# EAGLE design U2FHIDDevice_1 (EAGLE 7.7.0)

## Sheet 1 of 3
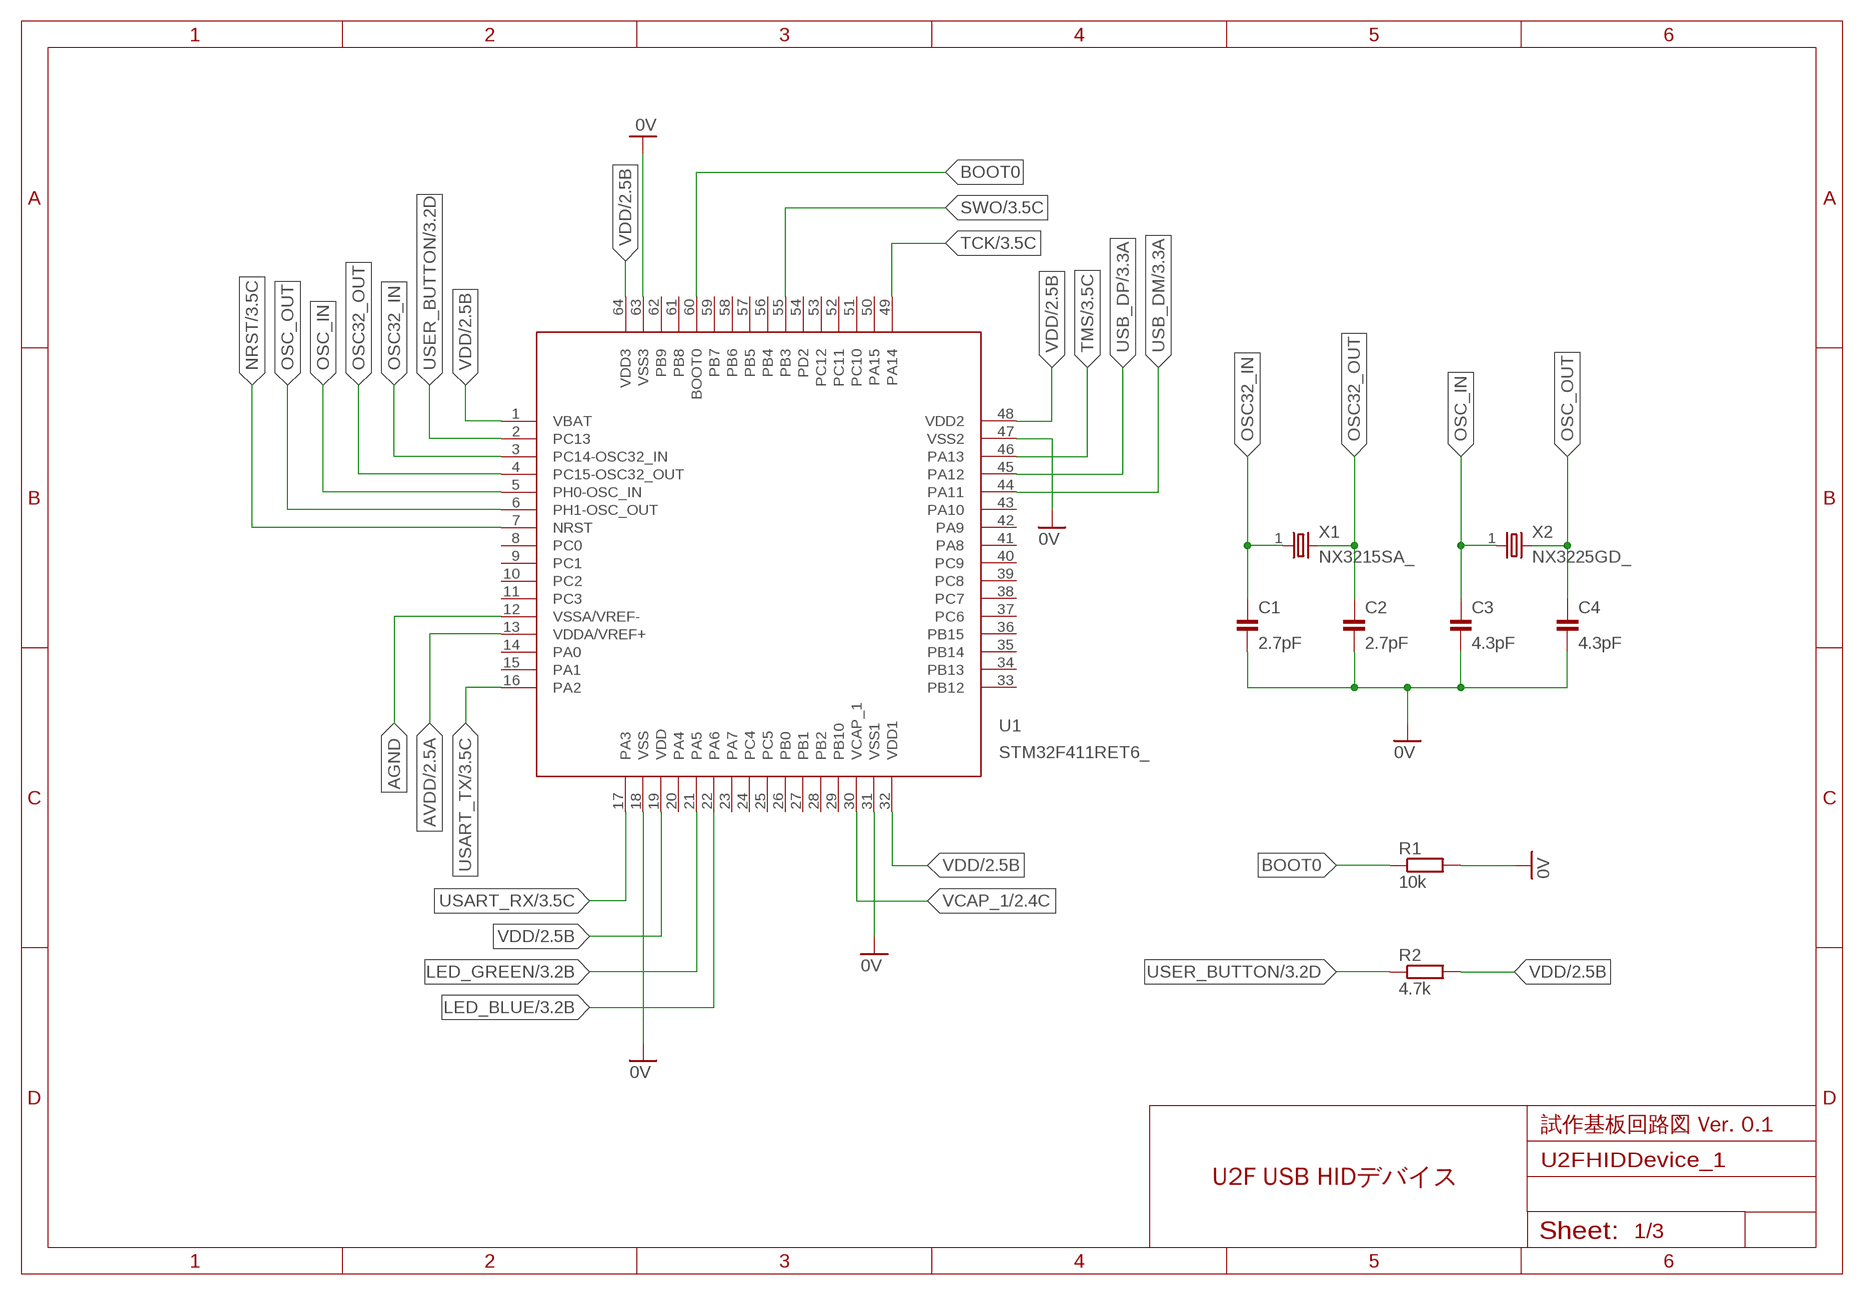
[diagram p0: schematic, sheet 1]

### Parts
C1  2.7pF  CAP_0603  [C0603K]
C2  2.7pF  CAP_0603  [C0603K]
C3  4.3pF  CAP_0603  [C0603K]
C4  4.3pF  CAP_0603  [C0603K]
R1  10k  RESISTOR_0603  [R0603]
R2  4.7k  RESISTOR_0603  [R0603]
U1  STM32F411RET6_  [LQFP64-10X10_DEV]
X1  NX3215SA_  [NX3215_DEV]
X2  NX3225GD_  [NX3225_DEV]

### Nets
0V: C1.2 C2.2 C3.2 C4.2 R1.2 U1.18(VSS) U1.31(VSS1) U1.47(VSS2) U1.63(VSS3) ; also sheet 2,3
AGND: U1.12(VSSA/VREF-) ; also sheet 2
AVDD: U1.13(VDDA/VREF+) ; also sheet 2
BOOT0: R1.1 U1.60(BOOT0)
LED_BLUE: U1.22(PA6) ; also sheet 3
LED_GREEN: U1.21(PA5) ; also sheet 3
NRST: U1.7(NRST) ; also sheet 3
OSC32_IN: C1.1 U1.3(PC14-OSC32_IN) X1.1
OSC32_OUT: C2.1 U1.4(PC15-OSC32_OUT) X1.2
OSC_IN: C3.1 U1.5(PH0-OSC_IN) X2.1
OSC_OUT: C4.1 U1.6(PH1-OSC_OUT) X2.2
SWO: U1.55(PB3) ; also sheet 3
TCK: U1.49(PA14) ; also sheet 3
TMS: U1.46(PA13) ; also sheet 3
USART_RX: U1.17(PA3) ; also sheet 3
USART_TX: U1.16(PA2) ; also sheet 3
USB_DM: U1.44(PA11) ; also sheet 3
USB_DP: U1.45(PA12) ; also sheet 3
USER_BUTTON: R2.1 U1.2(PC13) ; also sheet 3
VCAP_1: U1.30(VCAP_1) ; also sheet 2
VDD: R2.2 U1.1(VBAT) U1.19(VDD) U1.32(VDD1) U1.48(VDD2) U1.64(VDD3) ; also sheet 2
Unconnected: U1.8(PC0) U1.9(PC1) U1.10(PC2) U1.11(PC3) U1.14(PA0) U1.15(PA1) U1.20(PA4) U1.23(PA7) U1.24(PC4) U1.25(PC5) U1.26(PB0) U1.27(PB1) U1.28(PB2) U1.29(PB10) U1.33(PB12) U1.34(PB13) U1.35(PB14) U1.36(PB15) U1.37(PC6) U1.38(PC7) U1.39(PC8) U1.40(PC9) U1.41(PA8) U1.42(PA9) U1.43(PA10) U1.50(PA15) U1.51(PC10) U1.52(PC11) U1.53(PC12) U1.54(PD2) U1.56(PB4) U1.57(PB5) U1.58(PB6) U1.59(PB7) U1.61(PB8) U1.62(PB9)

### Notes on the sheet
- 試作基板回路図 Ver. 0.1
- U2F USB HIDデバイス

## Sheet 2 of 3
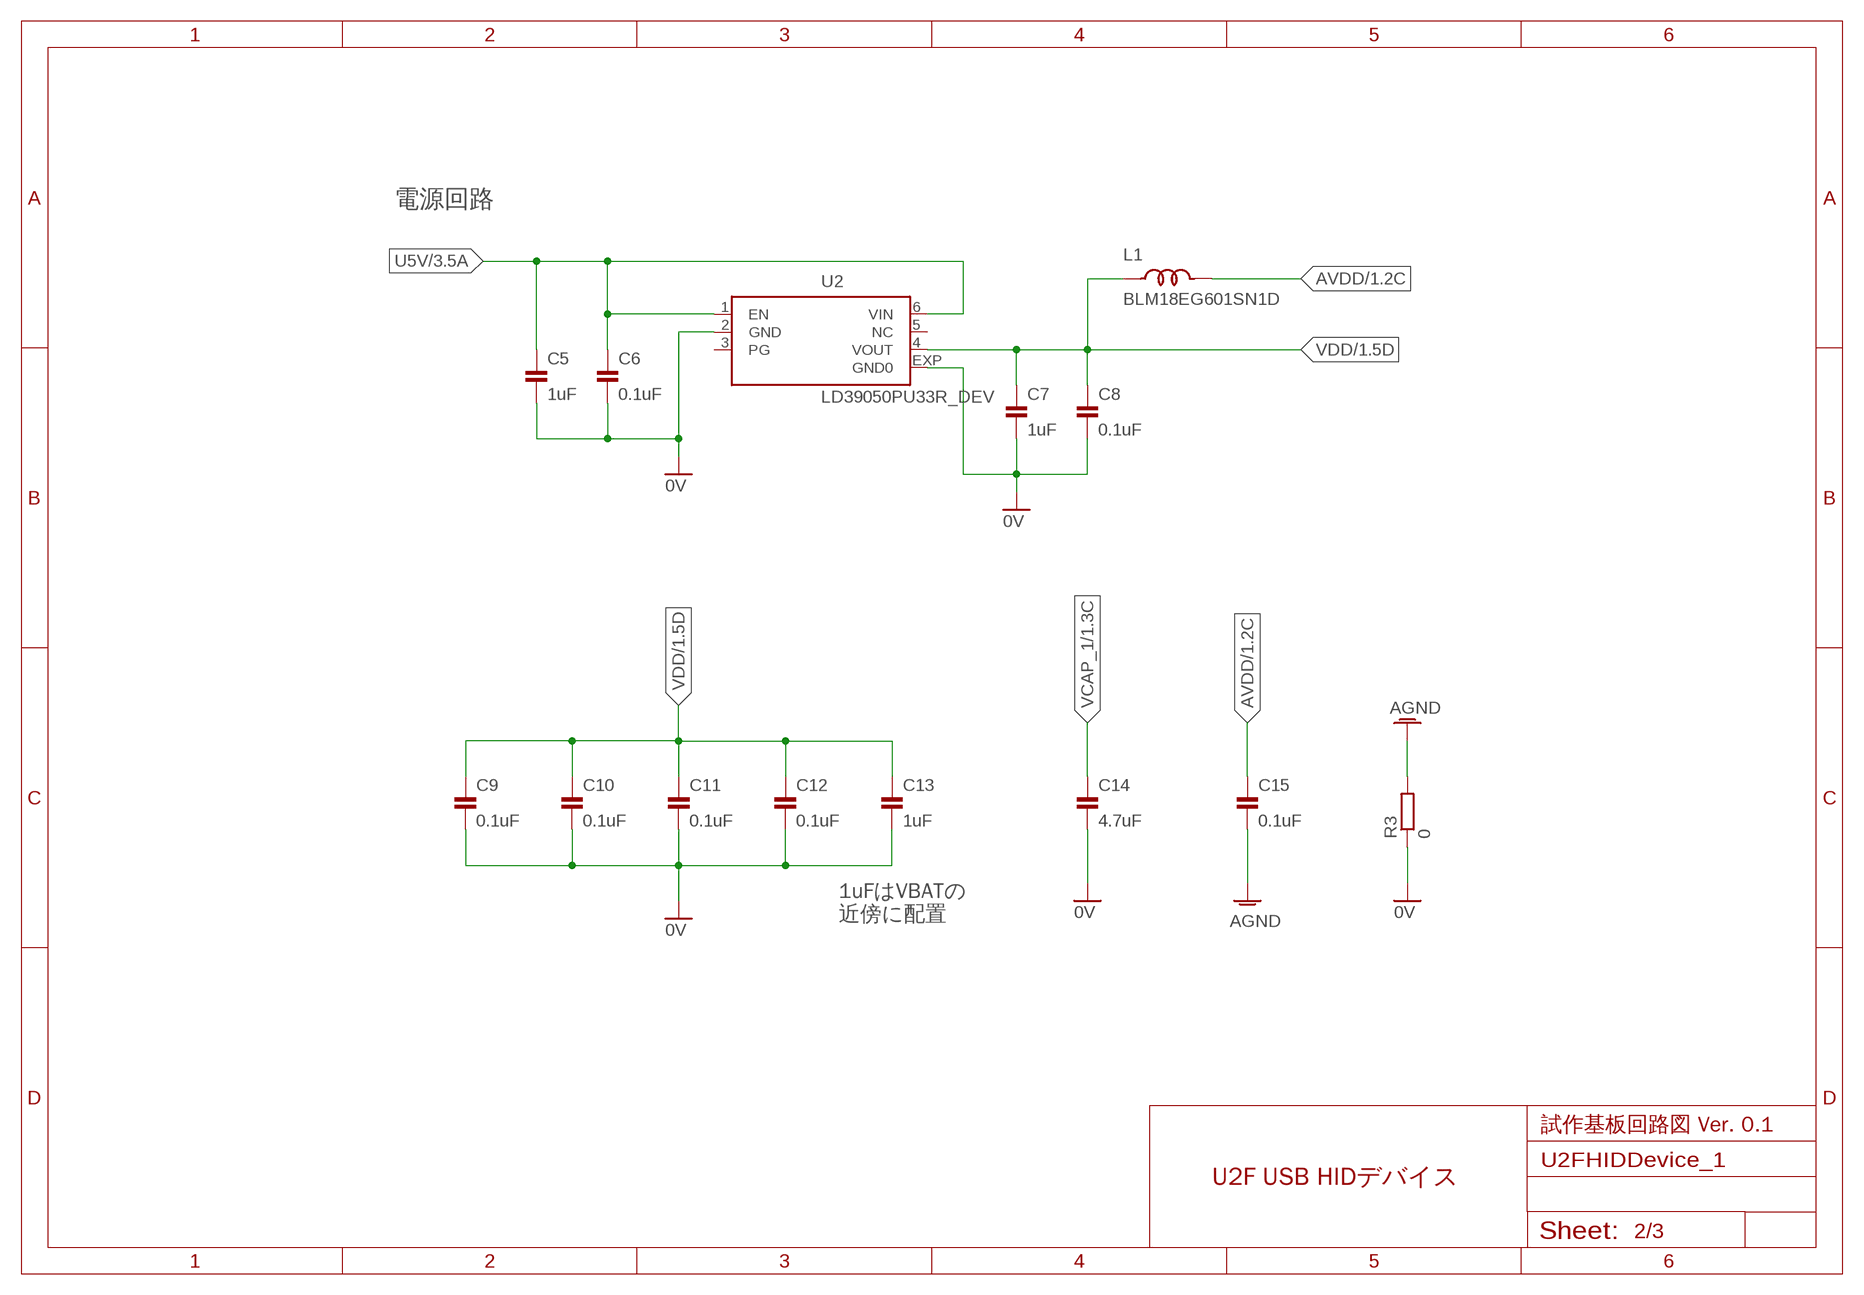
[diagram p1: schematic, sheet 2]

### Parts
C5  1uF  CAP_0603  [C0603K]
C6  0.1uF  CAP_0603  [C0603K]
C7  1uF  CAP_0603  [C0603K]
C8  0.1uF  CAP_0603  [C0603K]
C9  0.1uF  CAP_0603  [C0603K]
C10  0.1uF  CAP_0603  [C0603K]
C11  0.1uF  CAP_0603  [C0603K]
C12  0.1uF  CAP_0603  [C0603K]
C13  1uF  CAP_0603  [C0603K]
C14  4.7uF  CAP_1206  [C1206]
C15  0.1uF  CAP_0603  [C0603K]
L1  BLM18EG601SN1D  [R0603]
R3  0  RESISTOR_0603  [R0603]
U2  LD39050PU33R_DEV  [DFN6-3X3_DEV]

### Nets
0V: C5.2 C6.2 C7.2 C8.2 C9.2 C10.2 C11.2 C12.2 C13.2 C14.2 R3.1 U2.2(GND) U2.EXP(GND0) ; also sheet 1,3
AGND: C15.2 R3.2 ; also sheet 1
AVDD: C15.1 L1.2 ; also sheet 1
U5V: C5.1 C6.1 U2.1(EN) U2.6(VIN) ; also sheet 3
VCAP_1: C14.1 ; also sheet 1
VDD: C7.1 C8.1 C9.1 C10.1 C11.1 C12.1 C13.1 L1.1 U2.4(VOUT) ; also sheet 1
Unconnected: U2.3(PG) U2.5(NC)

### Notes on the sheet
- 電源回路
- 1uFはVBATの
  近傍に配置
- 試作基板回路図 Ver. 0.1
- U2F USB HIDデバイス

## Sheet 3 of 3
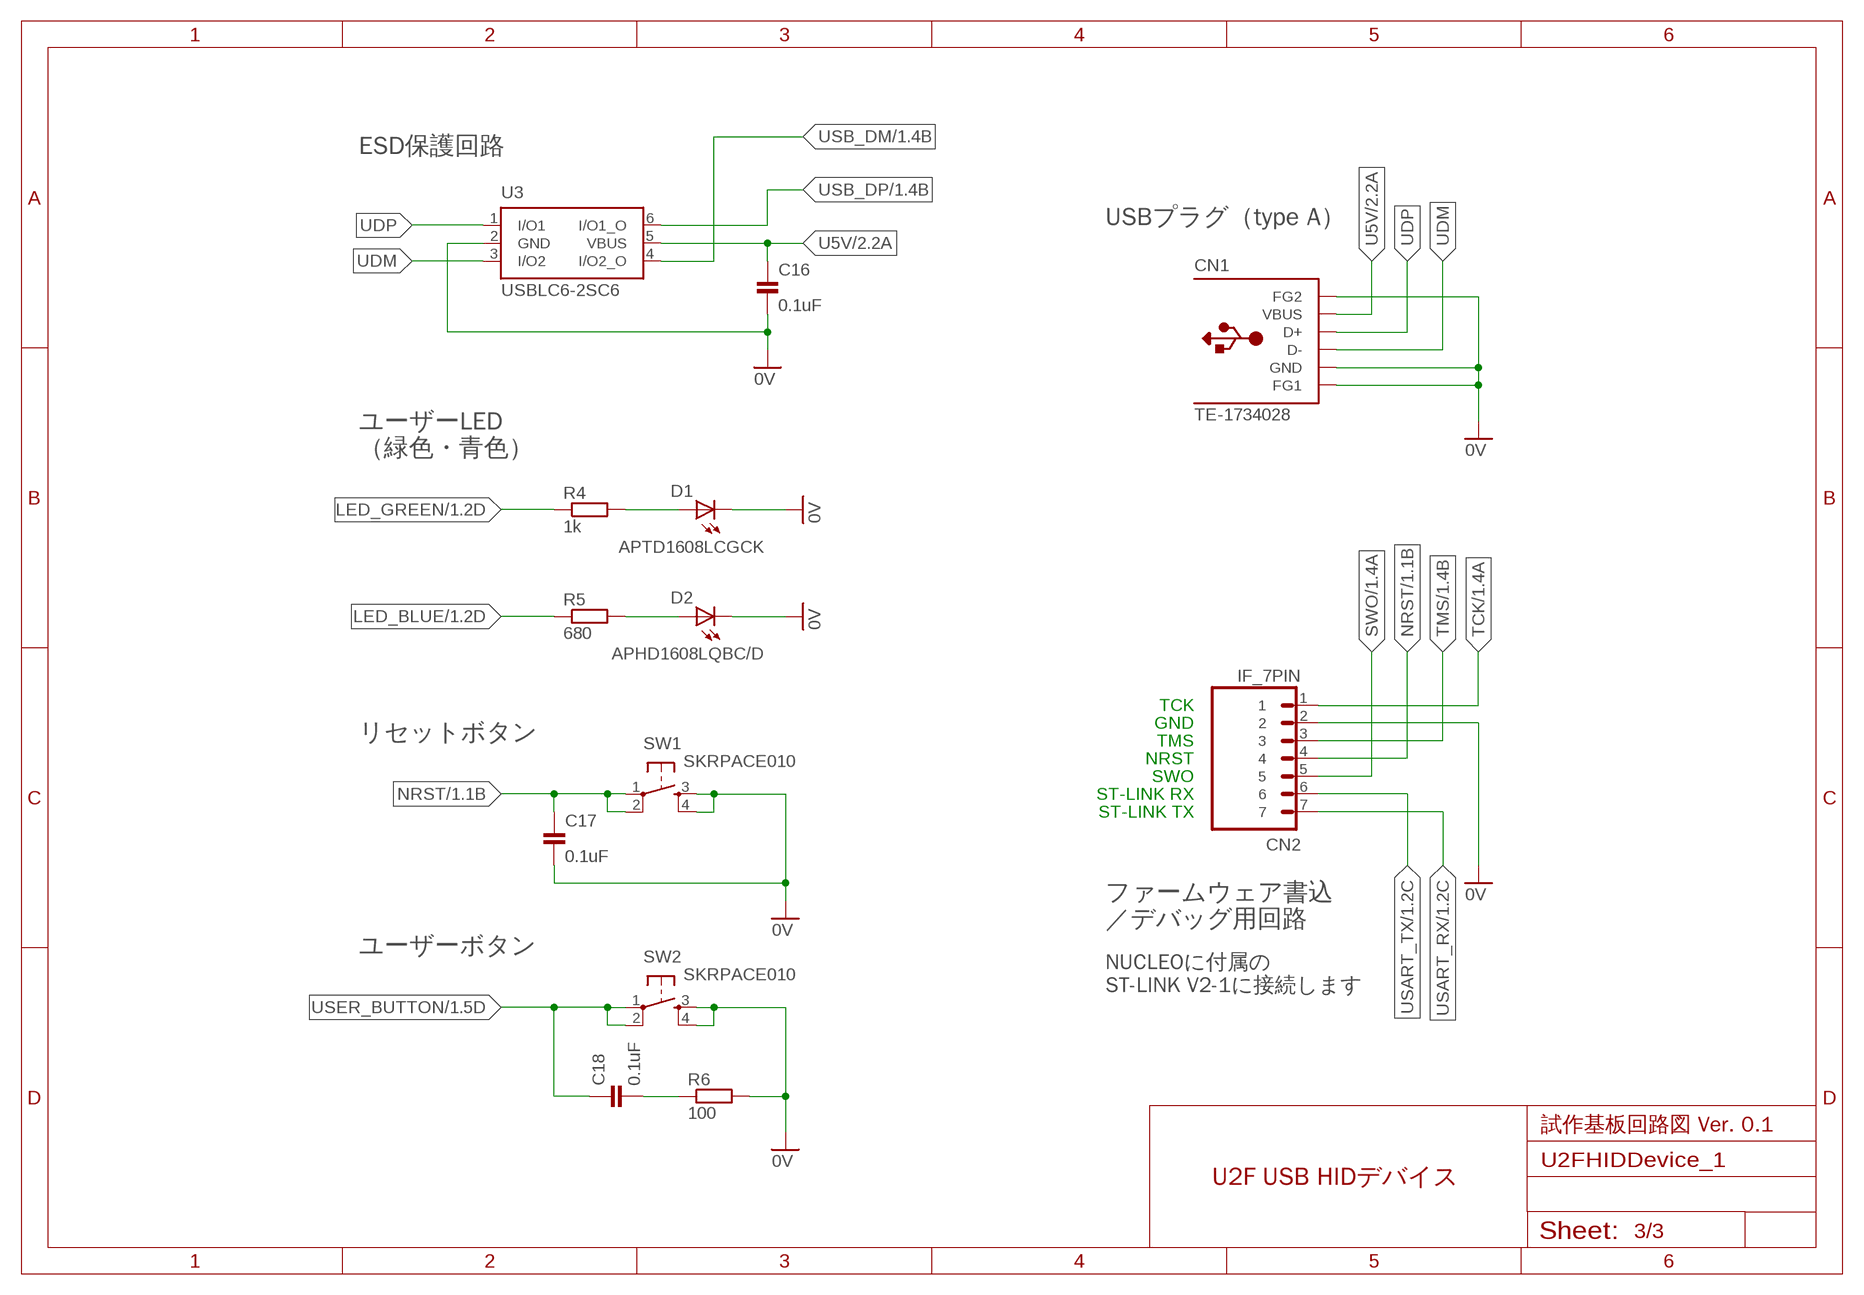
[diagram p2: schematic, sheet 3]

### Parts
C16  0.1uF  CAP_0603  [C0603K]
C17  0.1uF  CAP_0603  [C0603K]
C18  0.1uF  CAP_0603  [C0603K]
CN1  TE-1734028  [TE-1734028]
CN2  IF_7PIN  [HEADER_7PIN]
D1  APTD1608LCGCK  [CHIPLED_0603]
D2  APHD1608LQBC/D  [CHIPLED_0603]
R4  1k  RESISTOR_0603  [R0603]
R5  680  RESISTOR_0603  [R0603]
R6  100  RESISTOR_0603  [R0603]
SW1  SKRPACE010  [SKRPACE010]
SW2  SKRPACE010  [SKRPACE010]
U3  USBLC6-2SC6  [SOT23-6L]

### Nets
0V: C16.2 C17.2 CN1.FG1 CN1.FG2 CN1.P$4(GND) CN2.2 D1.C D2.C R6.2 SW1.3(S) SW1.4(S1) SW2.3(S) SW2.4(S1) U3.2(GND) ; also sheet 1,2
LED_BLUE: R5.1 ; also sheet 1
LED_GREEN: R4.1 ; also sheet 1
N$1: D1.A R4.2
N$2: C18.2 R6.1
N$4: D2.A R5.2
NRST: C17.1 CN2.4 SW1.1(P) SW1.2(P1) ; also sheet 1
SWO: CN2.5 ; also sheet 1
TCK: CN2.1 ; also sheet 1
TMS: CN2.3 ; also sheet 1
U5V: C16.1 CN1.P$1(VBUS) U3.5(VBUS) ; also sheet 2
UDM: CN1.P$2(D-) U3.3(I/O2)
UDP: CN1.P$3(D+) U3.1(I/O1)
USART_RX: CN2.7 ; also sheet 1
USART_TX: CN2.6 ; also sheet 1
USB_DM: U3.4(I/O2_O) ; also sheet 1
USB_DP: U3.6(I/O1_O) ; also sheet 1
USER_BUTTON: C18.1 SW2.1(P) SW2.2(P1) ; also sheet 1

### Notes on the sheet
- ESD保護回路
- USBプラグ（type A）
- ユーザーLED
  （緑色・青色）
- TCK
- GND
- リセットボタン | TMS
- NRST
- SWO
- ST-LINK RX
- ST-LINK TX
- ファームウェア書込
  ／デバッグ用回路
- ユーザーボタン
- NUCLEOに付属の
  ST-LINK V2-1に接続します
- 試作基板回路図 Ver. 0.1
- U2F USB HIDデバイス

## Library data of the parts
C1-C18 = Parts:CAP: コンデンサー
CN1 = Connectors:TE-1734028: USB connector plug TE Connectivity
CN2 = Connectors:IF_7PIN: 7-pin インターフェース
D1 = Parts:APTD1608: 発光ダイオード
D2 = Parts:APHD1608: 発光ダイオード
L1 = Parts:BLM18EG: フェライトビーズ インピーダンス: 100 Ohms @ 100 MHz 最大 DC 電流: 2 A 最大 DC 抵抗: 45 mOhms 動作温度範囲: - 55 C to + 125 C
R1-R6 = Parts:RESISTOR: 抵抗器
SW1 SW2 = Parts:SKRPACE010: 表面実装用タクトスイッチ ４．２×３．２ｍｍ小型重作動力タイプ ・作動力：２．５５Ｎ ・操作方向：垂直 ・移動量：０．２ｍｍ ・動作寿命：５０，０００ｃｙｃｌｅｓ （５ｍＡ ５ＶＤＣ） ・初期接触抵抗：最大５００ｍΩ
U1 = Parts:STM32F411RE: ARM マイクロコントローラ 最高クロック周波数: 100 MHz プログラム メモリ サイズ: 512 kB データ RAM サイズ: 128 kB ADC分解能: 12 bit I/O 数: 50 I/O 動作供給電圧: 3.3 V 最低動作温度: - 40 C 最高動作温度: + 85 C
U2 = Parts:LD39050PU33R: LDO電圧レギュレータ 出力電圧: 3.3 V 出力電流: 500 mA 入力電圧最大値: 5.5 V 最小入力電圧: + 1.5 V 出力タイプ: Fixed 最低動作温度: - 40 C 最高動作温度: + 125 C
U3 = Parts:USBLC6-2: Very low capacitance ESD protection
X1 = Parts:NX3215SA: 水晶振動子 周波数 32.768kHz 周波数公差 ±20ppm 負荷容量 6pF ESR（等価直列抵抗） 70 kOhms 動作温度 -40°C～85°C
X2 = Parts:NX3225GD: 水晶振動子 周波数 8MHz 周波数安定性 ±150ppm 周波数公差 ±50ppm 負荷容量 8pF ESR（等価直列抵抗） 500 Ohms 動作温度 -40°C～150°C 定格 AEC-Q200

## Board
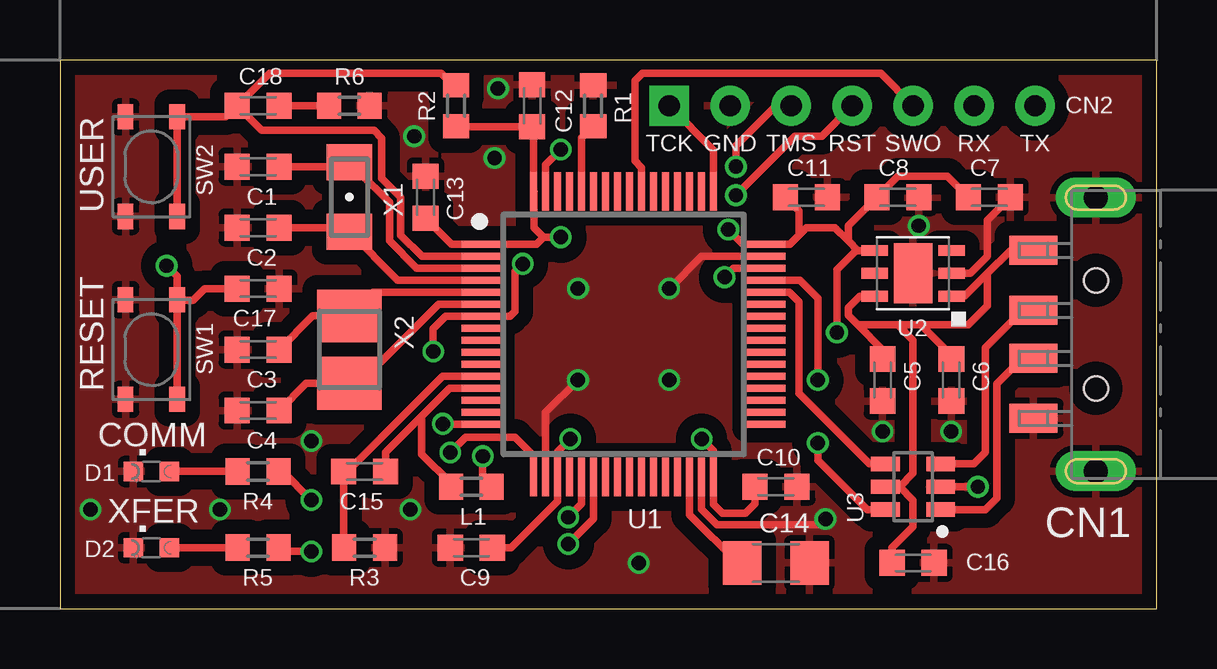
[diagram p3: board, top side]
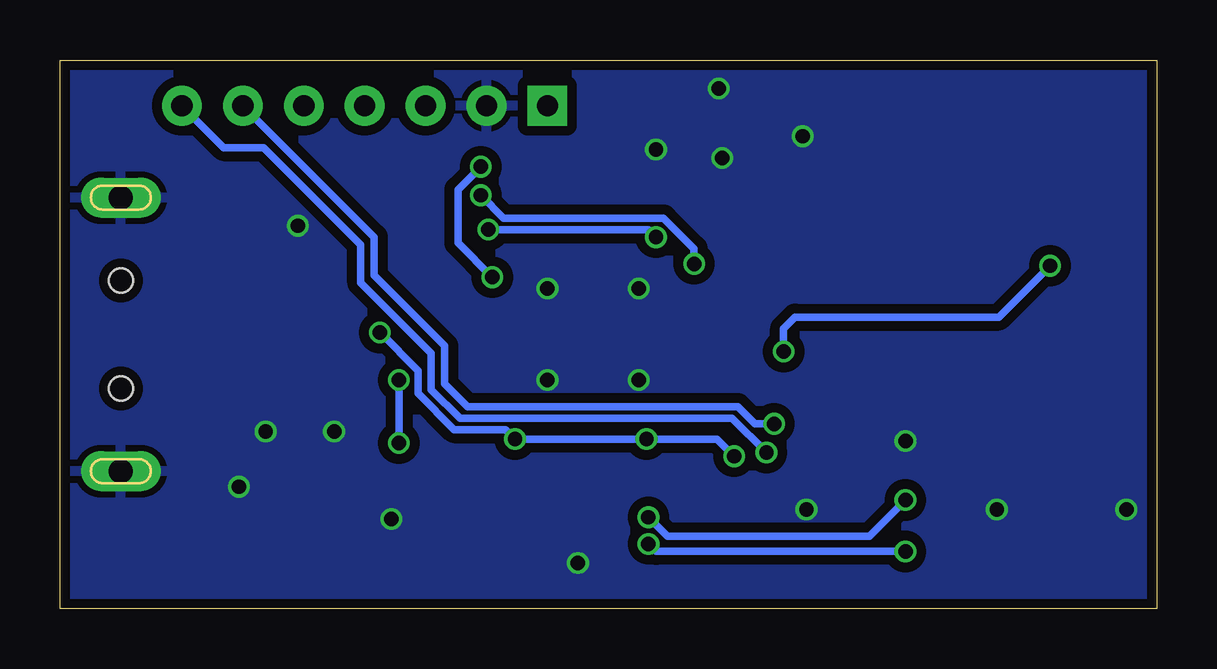
[diagram p4: board, bottom side, seen from below]

Size 45.72 x 22.86 mm. Coordinates in mm from the lower left corner, seen from the top.
Outline: 0,0 45.72,0 45.72,22.86 0,22.86 0,0
Copper layers (1*16): Top 0.035mm / dielectric 1.5mm / Bottom 0.035mm
Design rules "SeeedStudio_2layer_DRU_no_angle_20140221": minimum track width 6mil, minimum drill 12mil, track to track 6mil, track to pad 6mil, pad to pad 6mil, via to via 6mil, smd to smd 0mil, copper to edge 10mil, drill to drill 10mil, minimum pad ring 10mil, minimum via ring 6mil, stop-mask expansion 2mil, vias tented up to drill 100mil, thermal gap 10mil

### Footprints (pad centres in the part's own frame; a part is rotated, then mirrored left to right if it is on the bottom)
C0603K = smd 1.05 x 1.08: 1 -0.875,0; 2 0.875,0
C1206 = smd 1.6 x 1.8: 1 -1.4,0; 2 1.4,0
TE-1734028 = drill 1 pad 1.676 long: FG1 -5.7,0; FG2 5.7,0 | smd 1.2 x 2: P$1 3.5,2.6; P$2 1,2.6; P$3 -1,2.6; P$4 -3.5,2.6 | hole 1: -2.25,0; 2.25,0
HEADER_7PIN = drill 0.889 pad 1.651 square: 1 0,0 | drill 0.889 pad 1.651: 2 2.54,0; 3 5.08,0; 4 7.62,0; 5 10.16,0; 6 12.7,0; 7 15.24,0
CHIPLED_0603 = smd 0.8 x 0.8: A -0.75,0; C 0.75,0
R0603 = smd 1 x 1.1: 1 -0.85,0; 2 0.85,0
SKRPACE010 = smd 1.05 x 0.65: 1 -2.075,1.075; 2 2.075,1.075; 3 -2.075,-1.075; 4 2.075,-1.075
LQFP64-10X10_DEV = smd 1.6 x 0.3: 1 -5.95,3.75; 2 -5.95,3.25; 3 -5.95,2.75; 4 -5.95,2.25; 5 -5.95,1.75; 6 -5.95,1.25; 7 -5.95,0.75; 8 -5.95,0.25; 9 -5.95,-0.25; 10 -5.95,-0.75; 11 -5.95,-1.25; 12 -5.95,-1.75; 13 -5.95,-2.25; 14 -5.95,-2.75; 15 -5.95,-3.25; 16 -5.95,-3.75; 33 5.95,-3.75; 34 5.95,-3.25; 35 5.95,-2.75; 36 5.95,-2.25; 37 5.95,-1.75; 38 5.95,-1.25; 39 5.95,-0.75; 40 5.95,-0.25; 41 5.95,0.25; 42 5.95,0.75; 43 5.95,1.25; 44 5.95,1.75; 45 5.95,2.25; 46 5.95,2.75; 47 5.95,3.25; 48 5.95,3.75 | smd 0.3 x 1.6: 17 -3.75,-5.95; 18 -3.25,-5.95; 19 -2.75,-5.95; 20 -2.25,-5.95; 21 -1.75,-5.95; 22 -1.25,-5.95; 23 -0.75,-5.95; 24 -0.25,-5.95; 25 0.25,-5.95; 26 0.75,-5.95; 27 1.25,-5.95; 28 1.75,-5.95; 29 2.25,-5.95; 30 2.75,-5.95; 31 3.25,-5.95; 32 3.75,-5.95; 49 3.75,5.95; 50 3.25,5.95; 51 2.75,5.95; 52 2.25,5.95; 53 1.75,5.95; 54 1.25,5.95; 55 0.75,5.95; 56 0.25,5.95; 57 -0.25,5.95; 58 -0.75,5.95; 59 -1.25,5.95; 60 -1.75,5.95; 61 -2.25,5.95; 62 -2.75,5.95; 63 -3.25,5.95; 64 -3.75,5.95
DFN6-3X3_DEV = smd 1.1 x 0.45: 1 -1.6,0.95; 2 -1.6,0; 3 -1.6,-0.95; 4 1.6,-0.95; 5 1.6,0; 6 1.6,0.95 | smd 1.6 x 2.5: EXP 0,0
SOT23-6L = smd 0.6 x 1.2: 1 -0.95,-1.15; 2 0,-1.15; 3 0.95,-1.15; 4 0.95,1.15; 5 0,1.15; 6 -0.95,1.15
NX3215_DEV = smd 1.5 x 1.9: 1 -1.45,0; 2 1.45,0
NX3225_DEV = smd 2.2 x 2.7: 1 -1.4,0; 2 1.4,0

### Placement (x,y rotation side)
C1  8.26,18.41 180 top
C2  8.26,15.88 180 top
C3  8.26,10.79 180 top
C4  8.26,8.26 180 top
C5  34.29,9.53 270 top
C6  37.15,9.53 270 top
C7  38.73,17.14 0 top
C8  34.92,17.14 0 top
C9  17.14,2.54 180 top
C10  29.84,5.08 0 top
C11  31.11,17.14 0 top
C12  19.68,20.95 90 top
C13  15.24,17.14 90 top
C14  29.84,1.91 0 top
C15  12.7,5.71 180 top
C16  35.56,1.91 0 top
C17  8.26,13.34 0 top
C18  8.26,20.95 0 top
CN1  43.18,11.43 90 top
CN2  25.4,20.95 0 top
D1  3.81,5.71 180 top
D2  3.81,2.54 180 top
L1  17.14,5.08 180 top
R1  22.23,20.95 90 top
R2  16.51,20.95 270 top
R3  12.7,2.54 180 top
R4  8.26,5.71 180 top
R5  8.26,2.54 180 top
R6  12.06,20.95 0 top
SW1  3.81,10.79 270 top
SW2  3.81,18.41 270 top
U1  23.5,11.43 0 top
U2  35.56,13.97 180 top
U3  35.56,5.08 90 top
X1  12.06,17.14 270 top
X2  12.06,10.79 270 top

### Tracks (layer width: path | path; a pad name or v marks a point on that pad's centre or on a via)
0V  (via drill 0.6)
  Top 0.305: U3.2 v38.26,5.08 | U1.31 26.75,4.13 27.38,3.49 31.67,3.49 v31.91,3.73 | U1.18 20.25,8.18 v21.59,9.53 | U1.47 26.75,14.68 v25.4,13.34 | U2.2 37.94,13.97 38.66,14.68 38.66,16.19 C7.2 | U1.63 20.25,18.5 v20.88,19.13
  other vias: 21.59,13.34 25.4,9.53 34.29,7.38 10.48,6.99 6.67,4.13 14.61,4.13 18.11,18.77 1.27,4.13 35.8,15.95 37.15,7.38 14.76,19.68 18.26,21.67 24.13,1.91
  pour Bottom (isolate 0.406, rank 3): -2.54,25.4 48.26,25.4 48.26,-2.54 -2.54,-2.54
  pour Top (isolate 0.61, rank 3): -0.64,23.5 46.35,23.5 46.35,-0.64 -0.64,-0.64
AGND
  Top 0.305: R3.2 11.82,2.56 C15.2 11.99,5.71 15.95,9.68 U1.12
AVDD
  Top 0.305: C15.1 13.57,6.51 15.08,8.02 | L1.2 16.3,5.22 15.08,6.43 15.08,8.02 | 15.08,8.02 16.24,9.18 U1.13
BOOT0
  Top 0.305: U1.60 21.75,19.62 R1.1
LED_BLUE  (via drill 0.6)
  Top 0.305: v10.48,2.38 9.26,2.38 R5.1 | U1.22 22.25,3.75 v21.19,2.7
  Bottom 0.305: v10.48,2.38 20.88,2.38 v21.19,2.7
LED_GREEN  (via drill 0.6)
  Top 0.305: v10.48,4.52 9.29,5.71 R4.1 | U1.21 21.75,4.36 v21.19,3.81
  Bottom 0.305: v10.48,4.52 11.99,3.02 20.4,3.02 v21.19,3.81
N$1
  Top 0.305: D1.A R4.2
N$2
  Top 0.305: C18.2 R6.1
N$4
  Top 0.305: D2.A R5.2
NRST  (via drill 0.6)
  Top 0.305: v19.29,14.37 18.97,14.05 18.97,12.38 18.77,12.18 U1.7 16.07,12.18 15.56,11.67 v15.56,10.72 | CN2.4 31.75,19.68 30.64,19.68 v28.18,17.22 | SW1.1 SW1.2 | SW1.1 4.88,13.85 v4.45,14.29 | C17.1 6.03,13.34 5.56,12.86 4.9,12.86 SW1.1
  Bottom 0.305: v19.29,14.37 19.29,15 20.56,16.27 27.23,16.27 v28.18,17.22 | v15.56,10.72 15.56,11.67 15.08,12.14 6.59,12.14 v4.45,14.29
OSC32_IN
  Top 0.305: U1.3 14.87,14.18 13.73,15.32 13.73,16.93 12.43,18.23 12.24,18.41 | 12.24,18.41 X1.1 | C1.1 12.24,18.41
OSC32_OUT
  Top 0.305: U1.4 14.08,13.68 X1.2 11.88,15.88 C2.1
OSC_IN
  Top 0.305: U1.5 13.05,13.18 X2.1 10.53,12.2 C3.1
OSC_OUT
  Top 0.305: U1.6 15.78,12.68 12.49,9.39 X2.2 10.27,9.39 C4.1
SWO
  Top 0.305: CN2.5 34.21,22.3 24.29,22.3 23.97,21.99 23.97,18.65 24.25,18.38 U1.55
TCK
  Top 0.305: U1.49 27.25,19.11 CN2.1
TMS  (via drill 0.6)
  Top 0.305: U1.46 28.07,14.18 v27.7,13.81 | v28.18,18.41 28.18,19.29 29.84,20.95 CN2.3
  Bottom 0.305: v27.7,13.81 29.13,15.24 29.13,17.46 v28.18,18.41
U5V
  Top 0.305: C16.1 34.69,2.54 35.56,3.41 35.56,4.52 35,5.08 | U3.5 35,5.08 | 35,5.08 35.56,5.64 35.56,11.19 34.92,11.83 | 34.92,11.83 33.26,11.83 | 33.26,11.83 32.86,12.22 32.86,12.54 33.34,13.02 U2.6 | C6.1 37.15,10.56 35.88,11.83 | 35.88,11.83 34.92,11.83 | C5.1 34.29,10.79 33.26,11.83 | 35.88,11.83 37.86,11.83 38.66,12.62 38.66,13.97 | 38.66,13.97 39.61,14.92 CN1.P$1 | U2.1 37.71,13.02 38.66,13.97
UDM
  Top 0.305: U3.3 38.1,6.03 38.58,6.51 38.58,10.87 40.13,12.43 CN1.P$2
UDP
  Top 0.305: U3.1 38.58,4.13 39.05,4.6 39.05,9.37 40.12,10.43 CN1.P$3
USART_RX  (via drill 0.6)
  Top 0.305: U1.17 19.75,6.37 18.97,7.14 16.91,7.14 v16.27,6.51
  Bottom 0.305: CN2.7 38.89,19.21 37.23,19.21 33.18,15.16 33.18,13.57 30.24,10.64 30.24,9.13 29.05,7.94 17.7,7.94 v16.27,6.51
USART_TX  (via drill 0.6)
  Top 0.305: U1.16 15.81,7.68 v15.95,7.7
  Bottom 0.305: v15.95,7.7 16.75,7.7 17.46,8.41 28.73,8.41 29.69,9.37 29.69,10.95 32.62,13.89 32.62,15.48 CN2.6
USB_DM
  Top 0.305: U1.44 30.4,13.18 30.8,12.78 30.8,8.97 33.73,6.03 U3.4
USB_DP  (via drill 0.6)
  Top 0.305: v31.59,9.53 31.59,12.94 30.85,13.68 U1.45 | v31.59,6.91 31.59,6.19 33.65,4.13 U3.6
  Bottom 0.305: v31.59,9.53 v31.59,6.91
USER_BUTTON
  Top 0.305: U1.2 15.09,14.68 14.21,15.56 14.21,17.14 13.41,17.94 13.41,19.61 13.1,19.92 8.41,19.92 C18.1 | C18.1 6.92,20.49 SW2.1 SW2.2 | R2.1 16.37,21.8 15.88,22.3 8.73,22.3 C18.1
VCAP_1
  Top 0.305: U1.30 26.25,3.92 28.26,1.91 C14.1
VDD  (via drill 0.6)
  Top 0.305: U2.4 33.26,14.92 | 33.26,14.92 32.86,15.32 | 32.86,15.32 32.86,15.96 C8.1 34.92,18.02 36.99,18.02 C7.1 | C10.1 28.97,4.37 28.57,3.97 27.62,3.97 27.25,4.35 U1.32 27.25,6.57 v26.75,7.06 | 33.26,14.92 33.18,14.92 32.38,14.13 v32.38,11.51 | 30.8,15.56 30.42,15.18 U1.48 28.48,15.18 v27.86,15.8 | 30.8,15.56 30.8,16.59 C11.1 | 32.86,15.32 32.31,15.88 31.11,15.88 30.8,15.56 | C13.1 16.33,15.18 U1.1 19.86,15.18 20.16,15.48 | v20.88,15.48 20.16,15.48 | 20.16,15.48 19.76,15.88 19.76,17.36 U1.64 19.75,20.02 C12.1 16.54,20.08 R2.2 | 18.02,5.06 L1.1 17.62,5.45 v17.62,6.35 | C9.1 18.81,2.54 20.75,4.47 U1.19 20.75,6.54 v21.27,7.06
  Bottom 0.305: v32.38,11.51 30.8,9.92 30.8,8.97 29.29,7.46 27.15,7.46 v26.75,7.06 v21.27,7.06 18.34,7.06 v17.62,6.35 | v27.86,15.8 21.19,15.8 v20.88,15.48

### Text on the board
tPlace: TCK | GND | TMS | RST | SWO | RX | TX | USER | RESET | COMM | XFER